# Altium project BrewConEnd2.PrjPcb
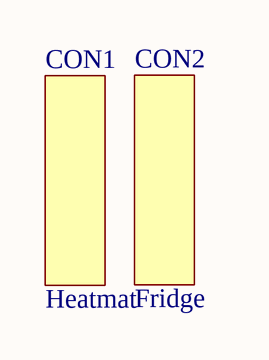
[diagram p0: EndCap2.SchDoc]
1 sheet, 2 parts. Net scope: global (net labels, ports and power ports of the same name join across sheets).
Board file: EndCap2.PcbDoc

## Sheet EndCap2.SchDoc
size A4

### Parts
CON1  Heatmat  [RA-02]
CON2  Fridge  [RA-02]

### Library data of the parts
CON1 CON2 = RA-02: Panel mount mains output socket; Manufacturer Part Number: RA-02